# Altium schematic sheet Driver.SchDoc: Gate Driver
size A3; Organization: ORGANIZATION; Address1: ADDRESS 1; Address2: ADDRESS 2; Address3: ADDRESS 3; Address4: ADDRESS 4; Revision: 0.0; SheetNumber: 3; SheetTotal: 19; ENG_APP_DATE: --/--/--; DSN_APP_DATE: --/--/--; CHK_APP_DATE: --/--/--
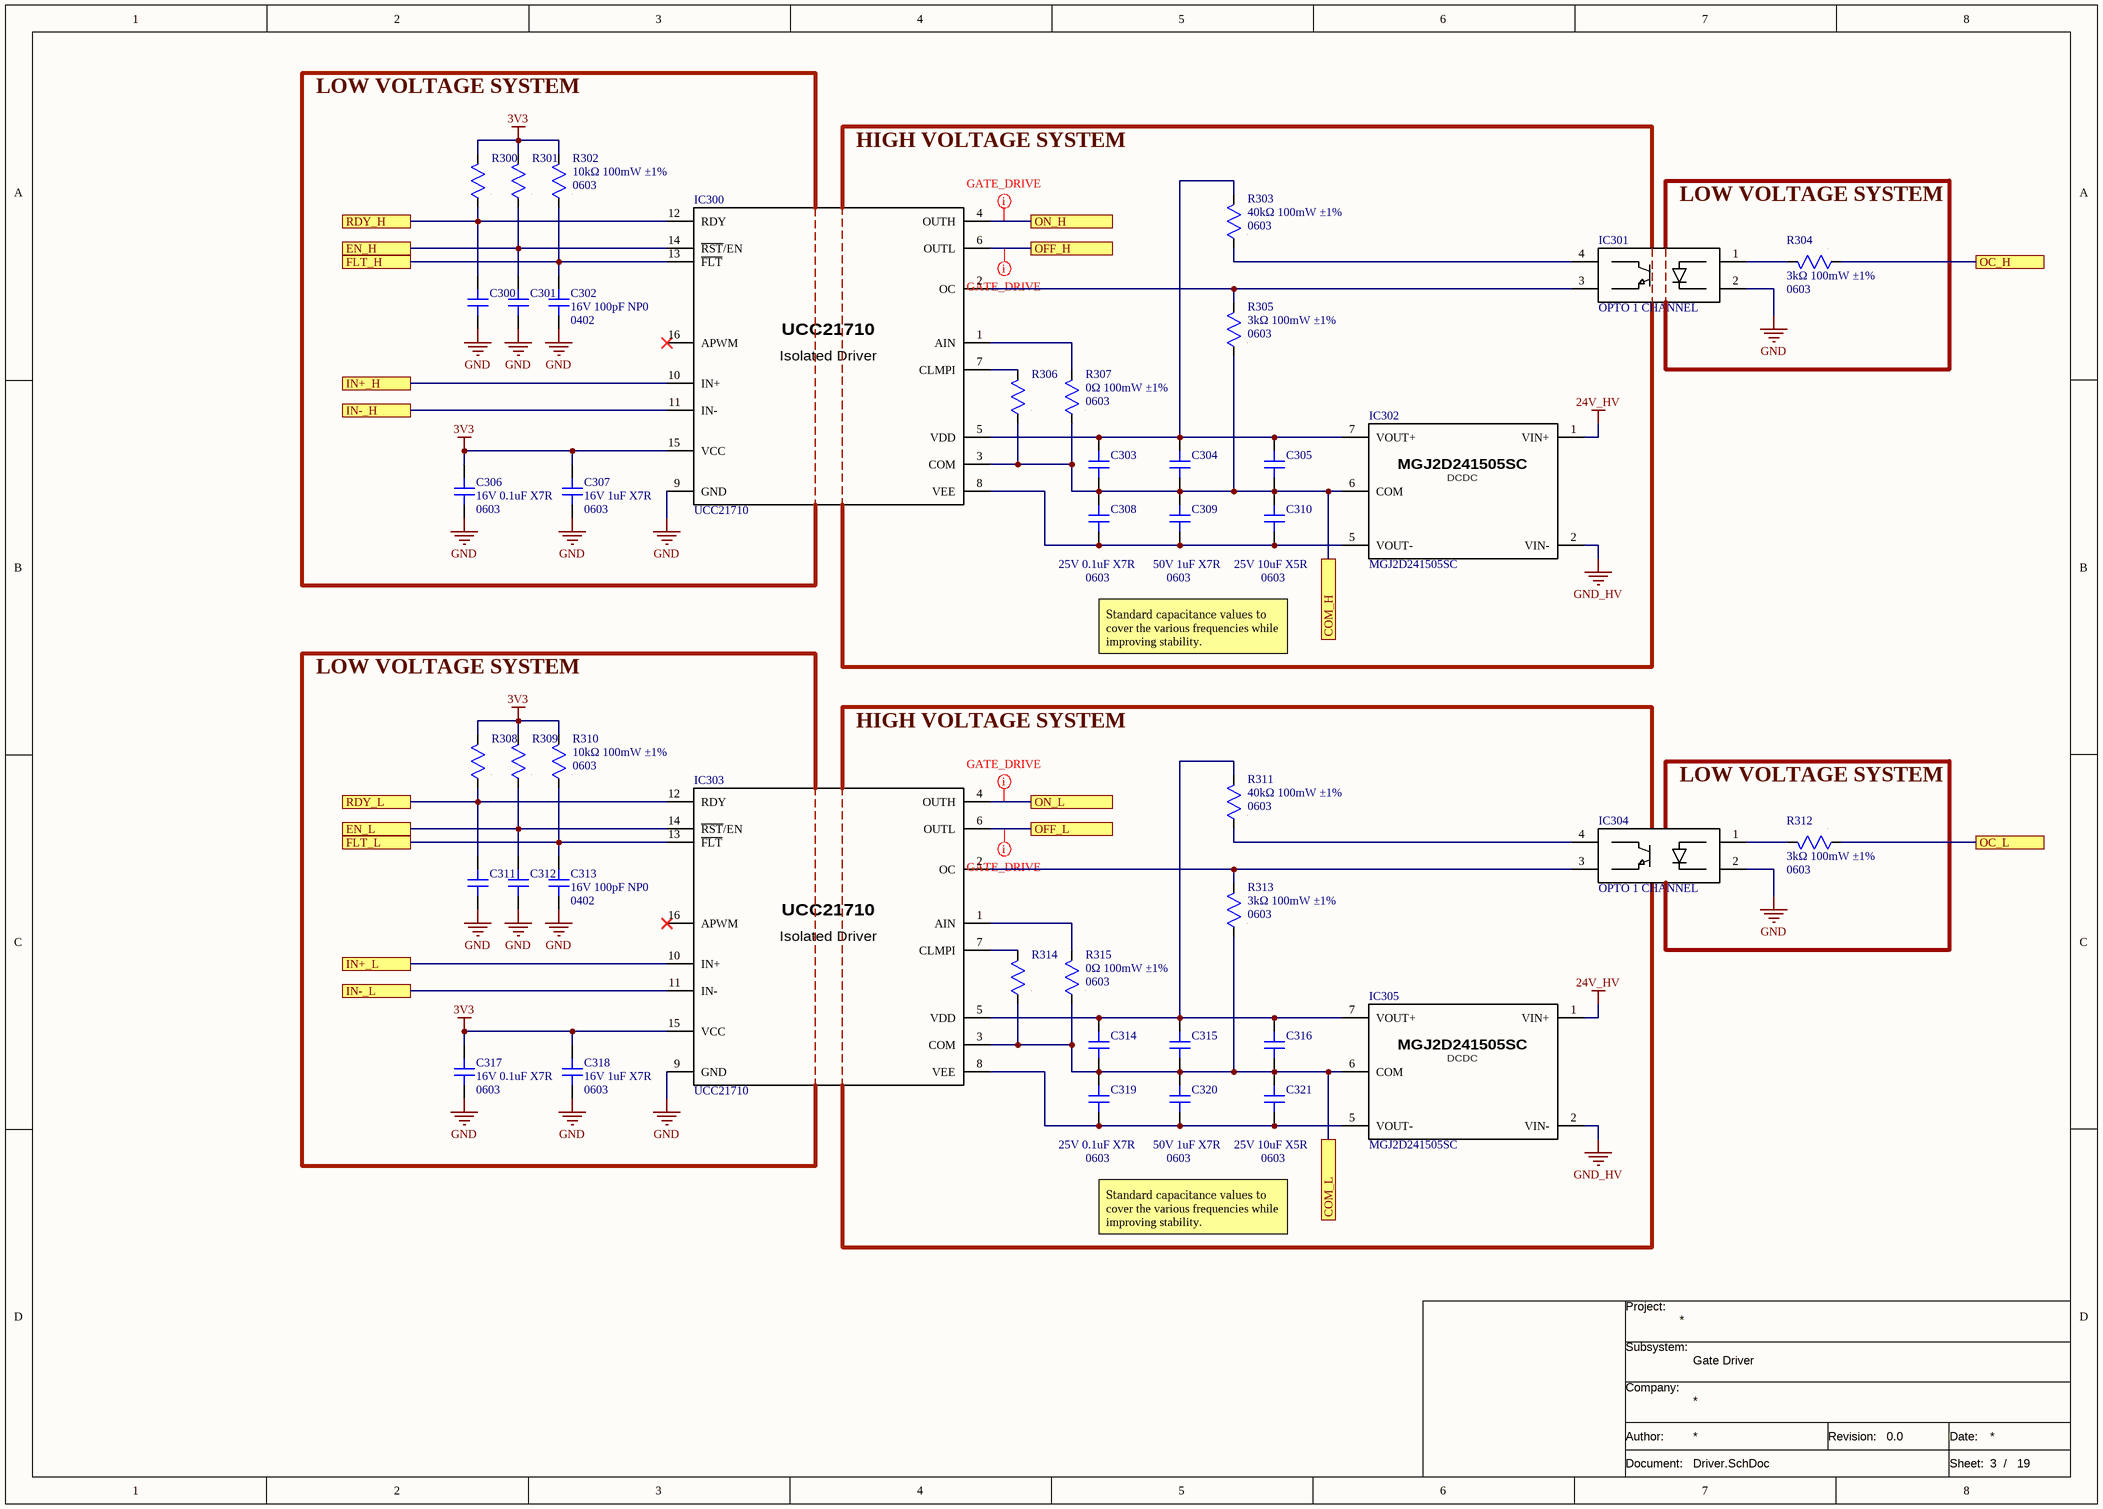
[diagram p0: Driver.SchDoc]

## Parts
C300  CAP non polarized  [CAP SMD 0402]  (value not drawn)
C301  CAP non polarized  [CAP SMD 0402]  (value not drawn)
C302  value 16V 100pF NP0  Package: 0402  [CAP SMD 0402]  (hidden comment: CAP non polarized)
C303  CAP non polarized  [CAP SMD 0603]  (value not drawn)
C304  CAP non polarized  [CAP SMD 0603]  (value not drawn)
C305  CAP non polarized  [CAP SMD 0603]  (value not drawn)
C306  value 16V 0.1uF X7R  Package: 0603  [CAP SMD 0603]  (hidden comment: CAP non polarized)
C307  value 16V 1uF X7R  Package: 0603  [CAP SMD 0603]  (hidden comment: CAP non polarized)
C308  value 25V 0.1uF X7R  Package: 0603  [CAP SMD 0603]  (hidden comment: CAP non polarized)
C309  value 50V 1uF X7R  Package: 0603  [CAP SMD 0603]  (hidden comment: CAP non polarized)
C310  value 25V 10uF X5R  Package: 0603  [CAP SMD 0603]  (hidden comment: CAP non polarized)
C311  CAP non polarized  [CAP SMD 0402]  (value not drawn)
C312  CAP non polarized  [CAP SMD 0402]  (value not drawn)
C313  value 16V 100pF NP0  Package: 0402  [CAP SMD 0402]  (hidden comment: CAP non polarized)
C314  CAP non polarized  [CAP SMD 0603]  (value not drawn)
C315  CAP non polarized  [CAP SMD 0603]  (value not drawn)
C316  CAP non polarized  [CAP SMD 0603]  (value not drawn)
C317  value 16V 0.1uF X7R  Package: 0603  [CAP SMD 0603]  (hidden comment: CAP non polarized)
C318  value 16V 1uF X7R  Package: 0603  [CAP SMD 0603]  (hidden comment: CAP non polarized)
C319  value 25V 0.1uF X7R  Package: 0603  [CAP SMD 0603]  (hidden comment: CAP non polarized)
C320  value 50V 1uF X7R  Package: 0603  [CAP SMD 0603]  (hidden comment: CAP non polarized)
C321  value 25V 10uF X5R  Package: 0603  [CAP SMD 0603]  (hidden comment: CAP non polarized)
IC300  UCC21710  [SOIC-16]
IC301  OPTO 1 CHANNEL  [SOIC-4]
IC302  MGJ2D241505SC  [MGJ2D241505SC]
IC303  UCC21710  [SOIC-16]
IC304  OPTO 1 CHANNEL  [SOIC-4]
IC305  MGJ2D241505SC  [MGJ2D241505SC]
R300  RES  [RES SMD 0603]  (value not drawn)
R301  RES  [RES SMD 0603]  (value not drawn)
R302  value 10kΩ 100mW ±1%  Package: 0603  [RES SMD 0603]  (hidden comment: RES)
R303  value 40kΩ 100mW ±1%  Package: 0603  [RES SMD 0603]  (hidden comment: RES)
R304  value 3kΩ 100mW ±1%  Package: 0603  [RES SMD 0603]  (hidden comment: RES)
R305  value 3kΩ 100mW ±1%  Package: 0603  [RES SMD 0603]  (hidden comment: RES)
R306  RES  [RES SMD 0603]  (value not drawn)
R307  value 0Ω 100mW ±1%  Package: 0603  [RES SMD 0603]  (hidden comment: RES)
R308  RES  [RES SMD 0603]  (value not drawn)
R309  RES  [RES SMD 0603]  (value not drawn)
R310  value 10kΩ 100mW ±1%  Package: 0603  [RES SMD 0603]  (hidden comment: RES)
R311  value 40kΩ 100mW ±1%  Package: 0603  [RES SMD 0603]  (hidden comment: RES)
R312  value 3kΩ 100mW ±1%  Package: 0603  [RES SMD 0603]  (hidden comment: RES)
R313  value 3kΩ 100mW ±1%  Package: 0603  [RES SMD 0603]  (hidden comment: RES)
R314  RES  [RES SMD 0603]  (value not drawn)
R315  value 0Ω 100mW ±1%  Package: 0603  [RES SMD 0603]  (hidden comment: RES)

## Blocks framed on the sheet
LOW VOLTAGE SYSTEM: R304

## Ports
COM_H, COM_L, EN_H, EN_L, FLT_H, FLT_L, IN+_H, IN+_L, IN-_H, IN-_L, OC_H, OC_L, OFF_H, OFF_L, ON_H, ON_L, RDY_H, RDY_L

## Nets
3V3: C306.1 C307.1 C317.1 C318.1 IC300.15(VCC) IC303.15(VCC) R300.2 R301.2 R302.2 R308.2 R309.2 R310.2
24V_HV: IC302.1(VIN+) IC305.1(VIN+)
GND: C300.2 C301.2 C302.2 C306.2 C307.2 C311.2 C312.2 C313.2 C317.2 C318.2 IC300.9(GND) IC301.2(K_1) IC303.9(GND) IC304.2(K_1)
GND_HV: IC302.2(VIN-) IC305.2(VIN-)
COM_H: C303.2 C304.2 C305.2 C308.1 C309.1 C310.1 IC300.3(COM) IC302.6(COM) R305.1 R306.1 R307.1 ; port COM_H
COM_L: C314.2 C315.2 C316.2 C319.1 C320.1 C321.1 IC303.3(COM) IC305.6(COM) R313.1 R314.1 R315.1 ; port COM_L
EN_H: C301.1 IC300.14(~{RST}/EN) R301.1 ; port EN_H
EN_L: C312.1 IC303.14(~{RST}/EN) R309.1 ; port EN_L
FLT_H: C302.1 IC300.13(~{FLT}) R302.1 ; port FLT_H
FLT_L: C313.1 IC303.13(~{FLT}) R310.1 ; port FLT_L
IN+_H: IC300.10(IN+) ; port IN+_H
IN+_L: IC303.10(IN+) ; port IN+_L
IN-_H: IC300.11(IN-) ; port IN-_H
IN-_L: IC303.11(IN-) ; port IN-_L
OC_H: R304.1 ; port OC_H
OC_L: R312.1 ; port OC_L
OFF_H: IC300.6(OUTL) ; port OFF_H
OFF_L: IC303.6(OUTL) ; port OFF_L
ON_H: IC300.4(OUTH) ; port ON_H
ON_L: IC303.4(OUTH) ; port ON_L
RDY_H: C300.1 IC300.12(RDY) R300.1 ; port RDY_H
RDY_L: C311.1 IC303.12(RDY) R308.1 ; port RDY_L
NetC303_1: C303.1 C304.1 C305.1 IC300.5(VDD) IC302.7(VOUT+) R303.2
NetC308_2: C308.2 C309.2 C310.2 IC300.8(VEE) IC302.5(VOUT-)
NetC314_1: C314.1 C315.1 C316.1 IC303.5(VDD) IC305.7(VOUT+) R311.2
NetC319_2: C319.2 C320.2 C321.2 IC303.8(VEE) IC305.5(VOUT-)
NetIC300_1: IC300.1(AIN) R307.2
NetIC300_2: IC300.2(OC) IC301.3(E_1) R305.2
NetIC300_7: IC300.7(CLMPI) R306.2
NetIC301_1: IC301.1(A_1) R304.2
NetIC301_4: IC301.4(C_1) R303.1
NetIC303_1: IC303.1(AIN) R315.2
NetIC303_2: IC303.2(OC) IC304.3(E_1) R313.2
NetIC303_7: IC303.7(CLMPI) R314.2
NetIC304_1: IC304.1(A_1) R312.2
NetIC304_4: IC304.4(C_1) R311.1

Not connected (* = marked no-connect by the designer): IC300 16(APWM)*; IC303 16(APWM)*

## Layout directives
net class GATE_DRIVE: OFF_H, OFF_L, ON_H, ON_L

## Notes on the sheet
- LOW VOLTAGE SYSTEM
- HIGH VOLTAGE SYSTEM
- Standard capacitance values ​​to cover the various frequencies while improving stability.
- Project:
- Subsystem:
- Company:
- Document:
- Author:
- Revision:
- Date:
- Sheet:
- /
- (in symbol 055-0001) Isolated Driver
- (in symbol 070-0005) DCDC

## Library data of the parts
C300 C301 C311 C312 = 001-0116: Condensadores de cerámica multicapa (MLCC- SMD/SMT) WCAP-CSGP 100pF 0402 5% 16V MLCC; MPN: 885012005031; Manufacturer: Wurth Elektronik; Value: 16V 100pF NP0; ComponentLink1Description: Datasheet; ComponentLink1URL: https://www.we-online.com/components/products/datasheet/885012005031.pdf; ComponentLink2Description: Distributor Link; ComponentLink2URL: https://www.mouser.es/ProductDetail/Wurth-Elektronik/885012005031?qs=0KOYDY2FL2%2FUQDbf4TYx%2Fw%3D%3D; Package: 0402; ID: 001-0116; Distributor PN: 710-885012005031; Distributor: Mouser
C302 C313 = 001-0116: Condensadores de cerámica multicapa (MLCC- SMD/SMT) WCAP-CSGP 100pF 0402 5% 16V MLCC; MPN: 885012005031; Manufacturer: Wurth Elektronik; ComponentLink1Description: Datasheet; ComponentLink1URL: https://www.we-online.com/components/products/datasheet/885012005031.pdf; ComponentLink2Description: Distributor Link; ComponentLink2URL: https://www.mouser.es/ProductDetail/Wurth-Elektronik/885012005031?qs=0KOYDY2FL2%2FUQDbf4TYx%2Fw%3D%3D; ID: 001-0116; Distributor PN: 710-885012005031; Distributor: Mouser
C303 C314 = 001-0115: Condensadores de cerámica multicapa (MLCC- SMD/SMT) WCAP-CSGP 0.1uF 0603 10% 25V MLCC; MPN: 885012206071; Manufacturer: Wurth Elektronik; Value: 25V 0.1uF X7R; ComponentLink1Description: Datasheet; ComponentLink1URL: https://www.we-online.com/components/products/datasheet/885012206071.pdf; ComponentLink2Description: Distributor Link; ComponentLink2URL: https://www.mouser.es/ProductDetail/Wurth-Elektronik/885012206071?qs=0KOYDY2FL2%2FEBQkuHgvarg%3D%3D; Package: 0603; ID: 001-0115; Distributor PN: 710-885012206071; Distributor: Mouser
C304 C315 = 001-0102: Condensadores de cerámica multicapa (MLCC- SMD/SMT) WCAP-CSGP 1uF 50 Vol 10%; MPN: 885012206126; Manufacturer: Wurth Elektronik; Value: 50V 1uF X7R; ComponentLink1Description: Datasheet; ComponentLink1URL: https://www.we-online.com/components/products/datasheet/885012206126.pdf; ComponentLink2Description: Distributor Link; ComponentLink2URL: https://www.mouser.es/ProductDetail/Wurth-Elektronik/885012206126?qs=amGC7iS6iy%2F%252BJOLb%2FSuwig%3D%3D; Package: 0603; ID: 001-0102; Distributor PN: 710-885012206126; Distributor: Mouser
C305 C316 = 001-0114: Condensadores de cerámica multicapa (MLCC- SMD/SMT) 0603 25VDC 10uF 10% X5R; MPN: ZRB18AR61E106KE01L; Manufacturer: muRata; Value: 25V 10uF X5R; ComponentLink1Description: Datasheet; ComponentLink1URL: https://www.mouser.es/ProductDetail/Murata-Electronics/ZRB18AR61E106KE01L?qs=sGAEpiMZZMsh%252B1woXyUXj%2Fze%252BJJ8bUKCZuLWV6qOmdQ%3D; ComponentLink2Description: Distributor Link; ComponentLink2URL: https://www.mouser.es/datasheet/3/76/2/ZRB18AR61E106KE01_02A.pdf; Package: 0603; ID: 001-0114; Distributor PN: 81-ZRB18AR61E106KE1L; Distributor: Mouser
C306 C317 = 001-0112: Condensadores de cerámica multicapa (MLCC- SMD/SMT) WCAP-CSGP 0.1uF 0603 10% 16V MLCC; MPN: 885012206046; Manufacturer: Wurth Elektronik; ComponentLink1Description: Datasheet; ComponentLink1URL: https://www.we-online.com/components/products/datasheet/885012206046.pdf; ComponentLink2Description: Distributor Link; ComponentLink2URL: https://www.mouser.es/ProductDetail/Wurth-Elektronik/885012206046?qs=0KOYDY2FL2%252B89gr6HvTBXA%3D%3D; ID: 001-0112; Distributor PN: 710-885012206046; Distributor: Mouser
C307 C318 = 001-0110: Condensadores de cerámica multicapa (MLCC- SMD/SMT) WCAP-CSGP 1uF 0603 10% 16V MLCC; MPN: 885012206052; Manufacturer: Wurth Elektronik; ComponentLink1Description: Datasheet; ComponentLink1URL: https://www.we-online.com/components/products/datasheet/885012206052.pdf; ComponentLink2Description: Distributor Link; ComponentLink2URL: https://www.mouser.es/ProductDetail/Wurth-Elektronik/885012206052?qs=0KOYDY2FL2%2F2JKabApojcQ%3D%3D; ID: 001-0110; Distributor PN: 710-885012206052; Distributor: Mouser
C308 C319 = 001-0115: Condensadores de cerámica multicapa (MLCC- SMD/SMT) WCAP-CSGP 0.1uF 0603 10% 25V MLCC; MPN: 885012206071; Manufacturer: Wurth Elektronik; ComponentLink1Description: Datasheet; ComponentLink1URL: https://www.we-online.com/components/products/datasheet/885012206071.pdf; ComponentLink2Description: Distributor Link; ComponentLink2URL: https://www.mouser.es/ProductDetail/Wurth-Elektronik/885012206071?qs=0KOYDY2FL2%2FEBQkuHgvarg%3D%3D; ID: 001-0115; Distributor PN: 710-885012206071; Distributor: Mouser
C309 C320 = 001-0102: Condensadores de cerámica multicapa (MLCC- SMD/SMT) WCAP-CSGP 1uF 50 Vol 10%; MPN: 885012206126; Manufacturer: Wurth Elektronik; ComponentLink1Description: Datasheet; ComponentLink1URL: https://www.we-online.com/components/products/datasheet/885012206126.pdf; ComponentLink2Description: Distributor Link; ComponentLink2URL: https://www.mouser.es/ProductDetail/Wurth-Elektronik/885012206126?qs=amGC7iS6iy%2F%252BJOLb%2FSuwig%3D%3D; ID: 001-0102; Distributor PN: 710-885012206126; Distributor: Mouser
C310 C321 = 001-0114: Condensadores de cerámica multicapa (MLCC- SMD/SMT) 0603 25VDC 10uF 10% X5R; MPN: ZRB18AR61E106KE01L; Manufacturer: muRata; ComponentLink1Description: Datasheet; ComponentLink1URL: https://www.mouser.es/ProductDetail/Murata-Electronics/ZRB18AR61E106KE01L?qs=sGAEpiMZZMsh%252B1woXyUXj%2Fze%252BJJ8bUKCZuLWV6qOmdQ%3D; ComponentLink2Description: Distributor Link; ComponentLink2URL: https://www.mouser.es/datasheet/3/76/2/ZRB18AR61E106KE01_02A.pdf; ID: 001-0114; Distributor PN: 81-ZRB18AR61E106KE1L; Distributor: Mouser
IC300 IC303 = 055-0001: Controladores de puerta con aislamiento galvánico Automotive 5.7kVrms 10A single-channel i A 595-UCC21710QDWQ1; MPN: UCC21710QDWRQ1; Manufacturer: Texas Instruments; ComponentLink1Description: Datasheet; ComponentLink1URL: https://www.ti.com/lit/ds/symlink/ucc21710-q1.pdf?ts=1780997053821&ref_url=https%253A%252F%252Fwww.ti.com%252Fproduct%252FUCC21710-Q1; ComponentLink2Description: Distributor Link; ComponentLink2URL: https://www.mouser.es/ProductDetail/Texas-Instruments/UCC21710QDWRQ1?qs=9r4v7xj2LnlqS59tMWgtnw%3D%3D; ID: 055-0001; Value: -; Package: SOIC-16; Distributor PN: 595-UCC21710QDWRQ1; Distributor: Mouser
IC301 IC304 = 041-0001: Optoacopladores para salidas de transistores Automotive DC-input transistor-output s; MPN: ISOM8110DFHRQ1; Manufacturer: Texas Instruments; ComponentLink1Description: Datasheet; ComponentLink1URL: https://www.ti.com/lit/ds/symlink/isom8118-q1.pdf?ts=1782232586415&ref_url=https%253A%252F%252Fwww.mouser.es%252F; ComponentLink2Description: Distributor Link; ComponentLink2URL: https://www.mouser.es/ProductDetail/Texas-Instruments/ISOM8110DFHRQ1?qs=7%2F6SraaimPTj7eqPn2eA2w%3D%3D; ID: 041-0001; Value: -; Package: SOIC-4; Distributor PN: 595-ISOM8110DFHRQ1; Distributor: Mouser
IC302 IC305 = 070-0005: Convertidores DC/DC para montaje pasante 2W 24-15VIN 5VOUT DC/DC; Manufacturer: Murata Power Solutions; Value: 24V-(15,-5)V; ComponentLink1Description: Datasheet; ComponentLink1URL: https://www.mouser.es/datasheet/3/76/1/kdc-mgj2.pdf; ComponentLink2Description: Distributor Link; ComponentLink2URL: https://www.mouser.es/ProductDetail/Murata-Power-Solutions/MGJ2D241505SC?qs=xLDY6iXSiQZSXeU7bFDLTA%3D%3D; ID: 070-0005; Package: 19.5x9.8x12.5mm; MPN: MGJ2D241505SC; Distributor PN: 580-MGJ2D241505SC; Distributor: Mouser
R300 R301 R308 R309 = 010-0145: Resistores de película gruesa - SMD WRIS-RSKS 10 kOhms 1 % 0.1 W 0603 AEC-Q200; MPN: 560112116005; Manufacturer: Wurth Elektronik; Value: 10kΩ 100mW ±1%; ComponentLink1Description: Datasheet; ComponentLink1URL: https://www.we-online.com/components/products/datasheet/560112116005.pdf; ComponentLink2Description: Distributor Link; ComponentLink2URL: https://www.mouser.es/ProductDetail/Wurth-Elektronik/560112116005?qs=mELouGlnn3dMVSPHwBGouA%3D%3D; Package: 0603; ID: 010-0145; Distributor PN: 710-560112116005; Distributor: Mouser
R302 R310 = 010-0145: Resistores de película gruesa - SMD WRIS-RSKS 10 kOhms 1 % 0.1 W 0603 AEC-Q200; MPN: 560112116005; Manufacturer: Wurth Elektronik; ComponentLink1Description: Datasheet; ComponentLink1URL: https://www.we-online.com/components/products/datasheet/560112116005.pdf; ComponentLink2Description: Distributor Link; ComponentLink2URL: https://www.mouser.es/ProductDetail/Wurth-Elektronik/560112116005?qs=mELouGlnn3dMVSPHwBGouA%3D%3D; ID: 010-0145; Distributor PN: 710-560112116005; Distributor: Mouser
R303 R311 = 010-0174: Thin Film Resistors 40kOhm 1/10W 0603 .1 %; MPN: RT0603BRD0740KL; Manufacturer: YAGEO; ComponentLink1Description: Datasheet; ComponentLink1URL: https://www.mouser.es/datasheet/3/72/1/PYU_RT_1_TO_0_01_ROHS_L.pdf; ComponentLink2Description: Distributor Link; ComponentLink2URL: https://www.mouser.es/ProductDetail/YAGEO/RT0603BRD0740KL?qs=sGAEpiMZZMvdGkrng054tz3%252BeNFGeSG0GkyUjI%2FdHogYz0a%2FQgLP3Q%3D%3D; ID: 010-0174; Distributor PN: 603-RT0603BRD0740KL; Distributor: Mouser
R304 R305 R312 R313 = 010-0175: Thin Film Resistors .1W 3Kohm 1% 0603 50ppm Auto; MPN: MCT06030C3001FP500; Manufacturer: Vishay; ComponentLink1Description: Datasheet; ComponentLink1URL: https://www.vishay.com/docs/28705/mcx0x0xpro.pdf; ComponentLink2Description: Distributor Link; ComponentLink2URL: https://www.mouser.es/ProductDetail/Vishay-Beyschlag/MCT06030C3001FP500?qs=sGAEpiMZZMvdGkrng054txcf3av6vnC8jqPtP2Mvtkc%3D; ID: 010-0175; Distributor PN: 594-MCT06030C3001FP5; Distributor: Mouser
R306 R314 = 010-0160: Resistores de película gruesa - SMD WRIS-RSKS <0.05 Ohms 0.1 W Jumper 0603 AEC-Q200; MPN: 5,60112116e+11; Manufacturer: Wurth Elektronik; Value: 0Ω 100mW ±1%; ComponentLink1Description: Datasheet; ComponentLink1URL: https://www.we-online.com/components/products/datasheet/560112116001.pdf; ComponentLink2Description: Distributor Link; ComponentLink2URL: https://www.mouser.es/ProductDetail/Wurth-Elektronik/560112116001?qs=mELouGlnn3dlnHYj7TecuA%3D%3D; Package: 0603; ID: 010-0160; Distributor PN: 710-560112116001; Distributor: Mouser
R307 R315 = 010-0160: Resistores de película gruesa - SMD WRIS-RSKS <0.05 Ohms 0.1 W Jumper 0603 AEC-Q200; MPN: 5,60112116e+11; Manufacturer: Wurth Elektronik; ComponentLink1Description: Datasheet; ComponentLink1URL: https://www.we-online.com/components/products/datasheet/560112116001.pdf; ComponentLink2Description: Distributor Link; ComponentLink2URL: https://www.mouser.es/ProductDetail/Wurth-Elektronik/560112116001?qs=mELouGlnn3dlnHYj7TecuA%3D%3D; ID: 010-0160; Distributor PN: 710-560112116001; Distributor: Mouser